# EAGLE schematic Main board (EAGLE 9.0.1)

## Sheet 1 of 2: General Board Outline
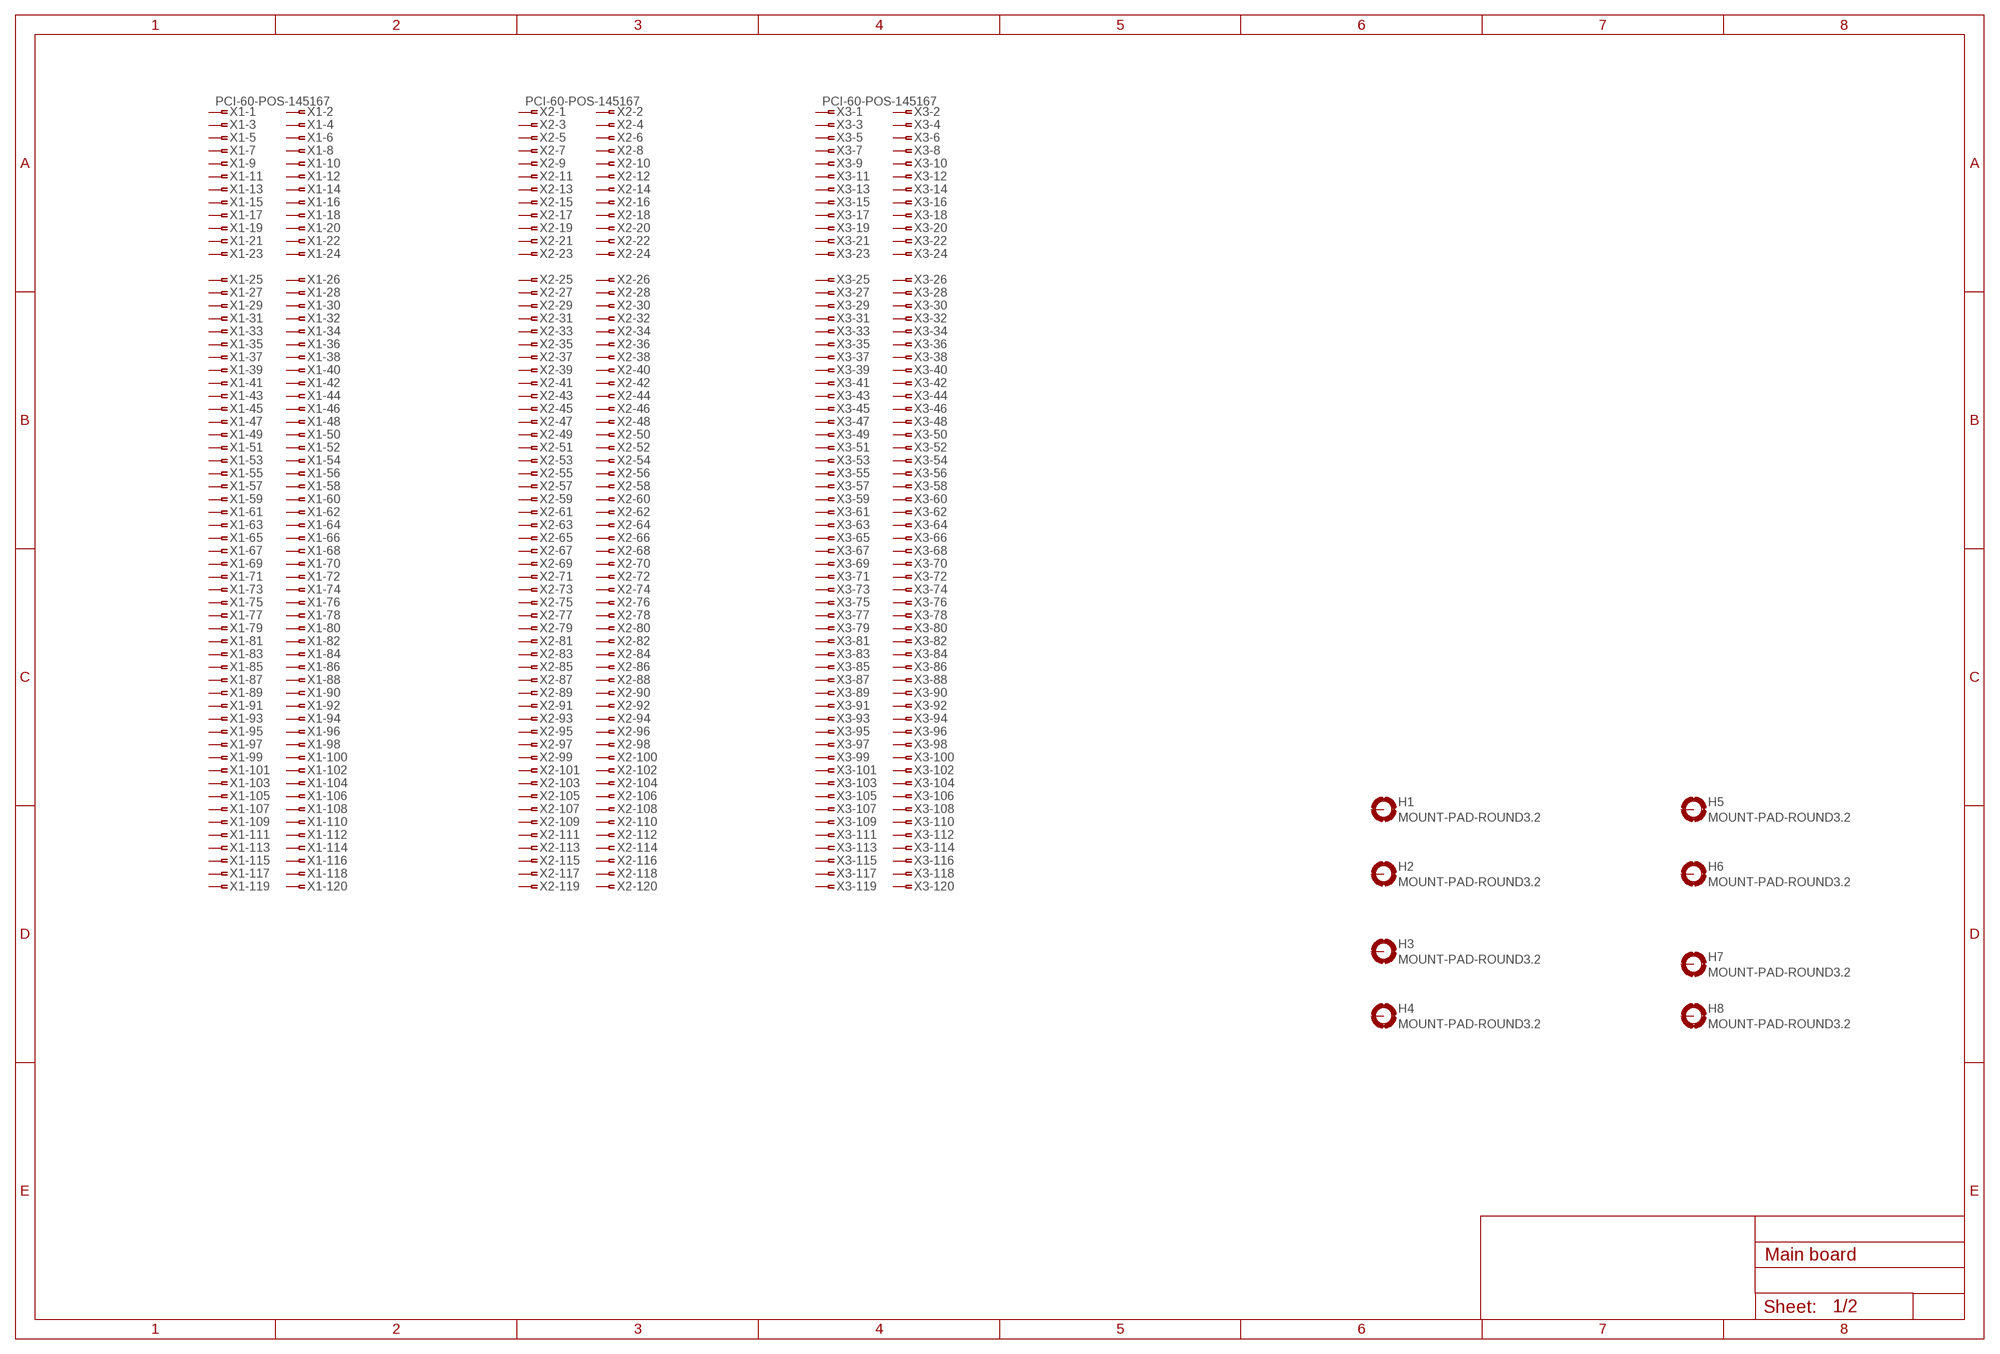
[diagram p0: schematic, sheet 1]

### Parts
H1  MOUNT-PAD-ROUND3.2  [3,2-PAD]
H2  MOUNT-PAD-ROUND3.2  [3,2-PAD]
H3  MOUNT-PAD-ROUND3.2  [3,2-PAD]
H4  MOUNT-PAD-ROUND3.2  [3,2-PAD]
H5  MOUNT-PAD-ROUND3.2  [3,2-PAD]
H6  MOUNT-PAD-ROUND3.2  [3,2-PAD]
H7  MOUNT-PAD-ROUND3.2  [3,2-PAD]
H8  MOUNT-PAD-ROUND3.2  [3,2-PAD]
X1  PCI-60-POS-145167  [145167-2]
X2  PCI-60-POS-145167  [145167-2]
X3  PCI-60-POS-145167  [145167-2]
Unconnected: H1.B3,2(MOUNT) H2.B3,2(MOUNT) H3.B3,2(MOUNT) H4.B3,2(MOUNT) H5.B3,2(MOUNT) H6.B3,2(MOUNT) H7.B3,2(MOUNT) H8.B3,2(MOUNT) X1.1 X1.2 X1.3 X1.4 X1.5 X1.6 X1.7 X1.8 X1.9 X1.10 X1.11 X1.12 X1.13 X1.14 X1.15 X1.16 X1.17 X1.18 X1.19 X1.20 X1.21 X1.22 X1.23 X1.24 X1.25 X1.26 X1.27 X1.28 X1.29 X1.30 X1.31 X1.32 X1.33 X1.34 X1.35 X1.36 X1.37 X1.38 X1.39 X1.40 X1.41 X1.42 X1.43 X1.44 X1.45 X1.46 X1.47 X1.48 X1.49 X1.50 X1.51 X1.52 X1.53 X1.54 X1.55 X1.56 X1.57 X1.58 X1.59 X1.60 X1.61 X1.62 X1.63 X1.64 X1.65 X1.66 X1.67 X1.68 X1.69 X1.70 X1.71 X1.72 X1.73 X1.74 X1.75 X1.76 X1.77 X1.78 X1.79 X1.80 X1.81 X1.82 X1.83 X1.84 X1.85 X1.86 X1.87 X1.88 X1.89 X1.90 X1.91 X1.92 X1.93 X1.94 X1.95 X1.96 X1.97 X1.98 X1.99 X1.100 X1.101 X1.102 X1.103 X1.104 X1.105 X1.106 X1.107 X1.108 X1.109 X1.110 X1.111 X1.112 X1.113 X1.114 X1.115 X1.116 X1.117 X1.118 X1.119 X1.120 X2.1 X2.2 X2.3 X2.4 X2.5 X2.6 X2.7 X2.8 X2.9 X2.10 X2.11 X2.12 X2.13 X2.14 X2.15 X2.16 X2.17 X2.18 X2.19 X2.20 X2.21 X2.22 X2.23 X2.24 X2.25 X2.26 X2.27 X2.28 X2.29 X2.30 X2.31 X2.32 X2.33 X2.34 X2.35 X2.36 X2.37 X2.38 X2.39 X2.40 X2.41 X2.42 X2.43 X2.44 X2.45 X2.46 X2.47 X2.48 X2.49 X2.50 X2.51 X2.52 X2.53 X2.54 X2.55 X2.56 X2.57 X2.58 X2.59 X2.60 X2.61 X2.62 X2.63 X2.64 X2.65 X2.66 X2.67 X2.68 X2.69 X2.70 X2.71 X2.72 X2.73 X2.74 X2.75 X2.76 X2.77 X2.78 X2.79 X2.80 X2.81 X2.82 X2.83 X2.84 X2.85 X2.86 X2.87 X2.88 X2.89 X2.90 X2.91 X2.92 X2.93 X2.94 X2.95 X2.96 X2.97 X2.98 X2.99 X2.100 X2.101 X2.102 X2.103 X2.104 X2.105 X2.106 X2.107 X2.108 X2.109 X2.110 X2.111 X2.112 X2.113 X2.114 X2.115 X2.116 X2.117 X2.118 X2.119 X2.120 X3.1 X3.2 X3.3 X3.4 X3.5 X3.6 X3.7 X3.8 X3.9 X3.10 X3.11 X3.12 X3.13 X3.14 X3.15 X3.16 X3.17 X3.18 X3.19 X3.20 X3.21 X3.22 X3.23 X3.24 X3.25 X3.26 X3.27 X3.28 X3.29 X3.30 X3.31 X3.32 X3.33 X3.34 X3.35 X3.36 X3.37 X3.38 X3.39 X3.40 X3.41 X3.42 X3.43 X3.44 X3.45 X3.46 X3.47 X3.48 X3.49 X3.50 X3.51 X3.52 X3.53 X3.54 X3.55 X3.56 X3.57 X3.58 X3.59 X3.60 X3.61 X3.62 X3.63 X3.64 X3.65 X3.66 X3.67 X3.68 X3.69 X3.70 X3.71 X3.72 X3.73 X3.74 X3.75 X3.76 X3.77 X3.78 X3.79 X3.80 X3.81 X3.82 X3.83 X3.84 X3.85 X3.86 X3.87 X3.88 X3.89 X3.90 X3.91 X3.92 X3.93 X3.94 X3.95 X3.96 X3.97 X3.98 X3.99 X3.100 X3.101 X3.102 X3.103 X3.104 X3.105 X3.106 X3.107 X3.108 X3.109 X3.110 X3.111 X3.112 X3.113 X3.114 X3.115 X3.116 X3.117 X3.118 X3.119 X3.120

## Sheet 2 of 2: Logo
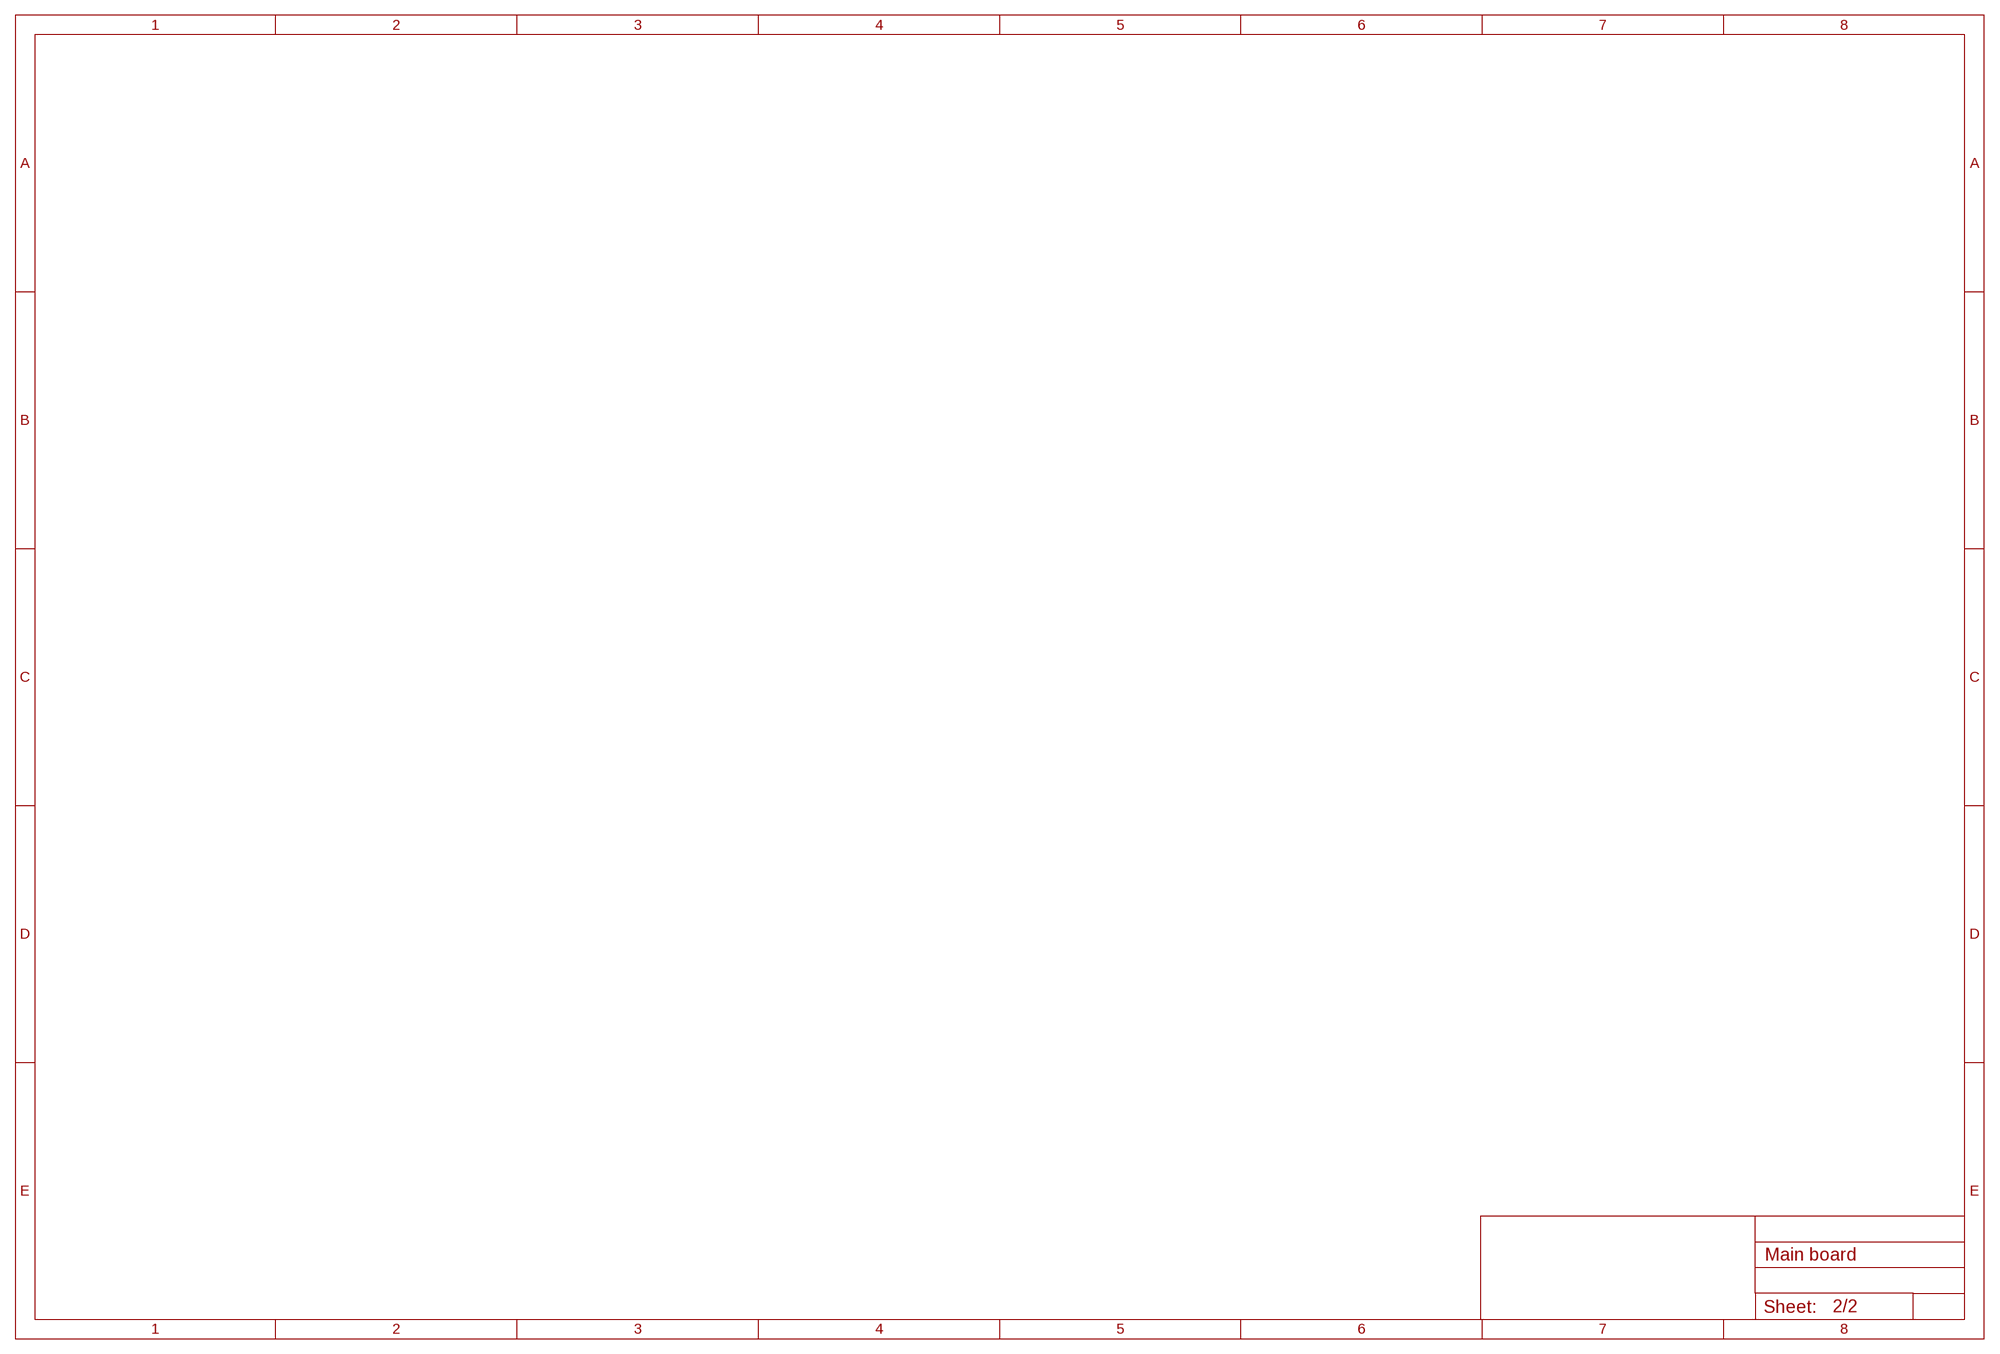
[diagram p1: schematic, sheet 2]

## Library data of the parts
H1-H8 = holes:MOUNT-PAD-ROUND: MOUNTING PAD, round
X1-X3 = con-amp:PCI-60-POS: PCI-SLOT 60 Dual Position 0.05 Series Standard Edge Source: http://catalog.tycoelectronics.com .. ENG_CD_145167_F.pdf

## Net classes
1 power: width 0.152 mm, drill 0.152 mm, clearance 0.152 mm
2 gnd: width 0.152 mm, drill 0.152 mm, clearance 0.152 mm